# EAGLE design MUDE - Rev B (EAGLE 7.3.0)

## Sheet 1 of 2
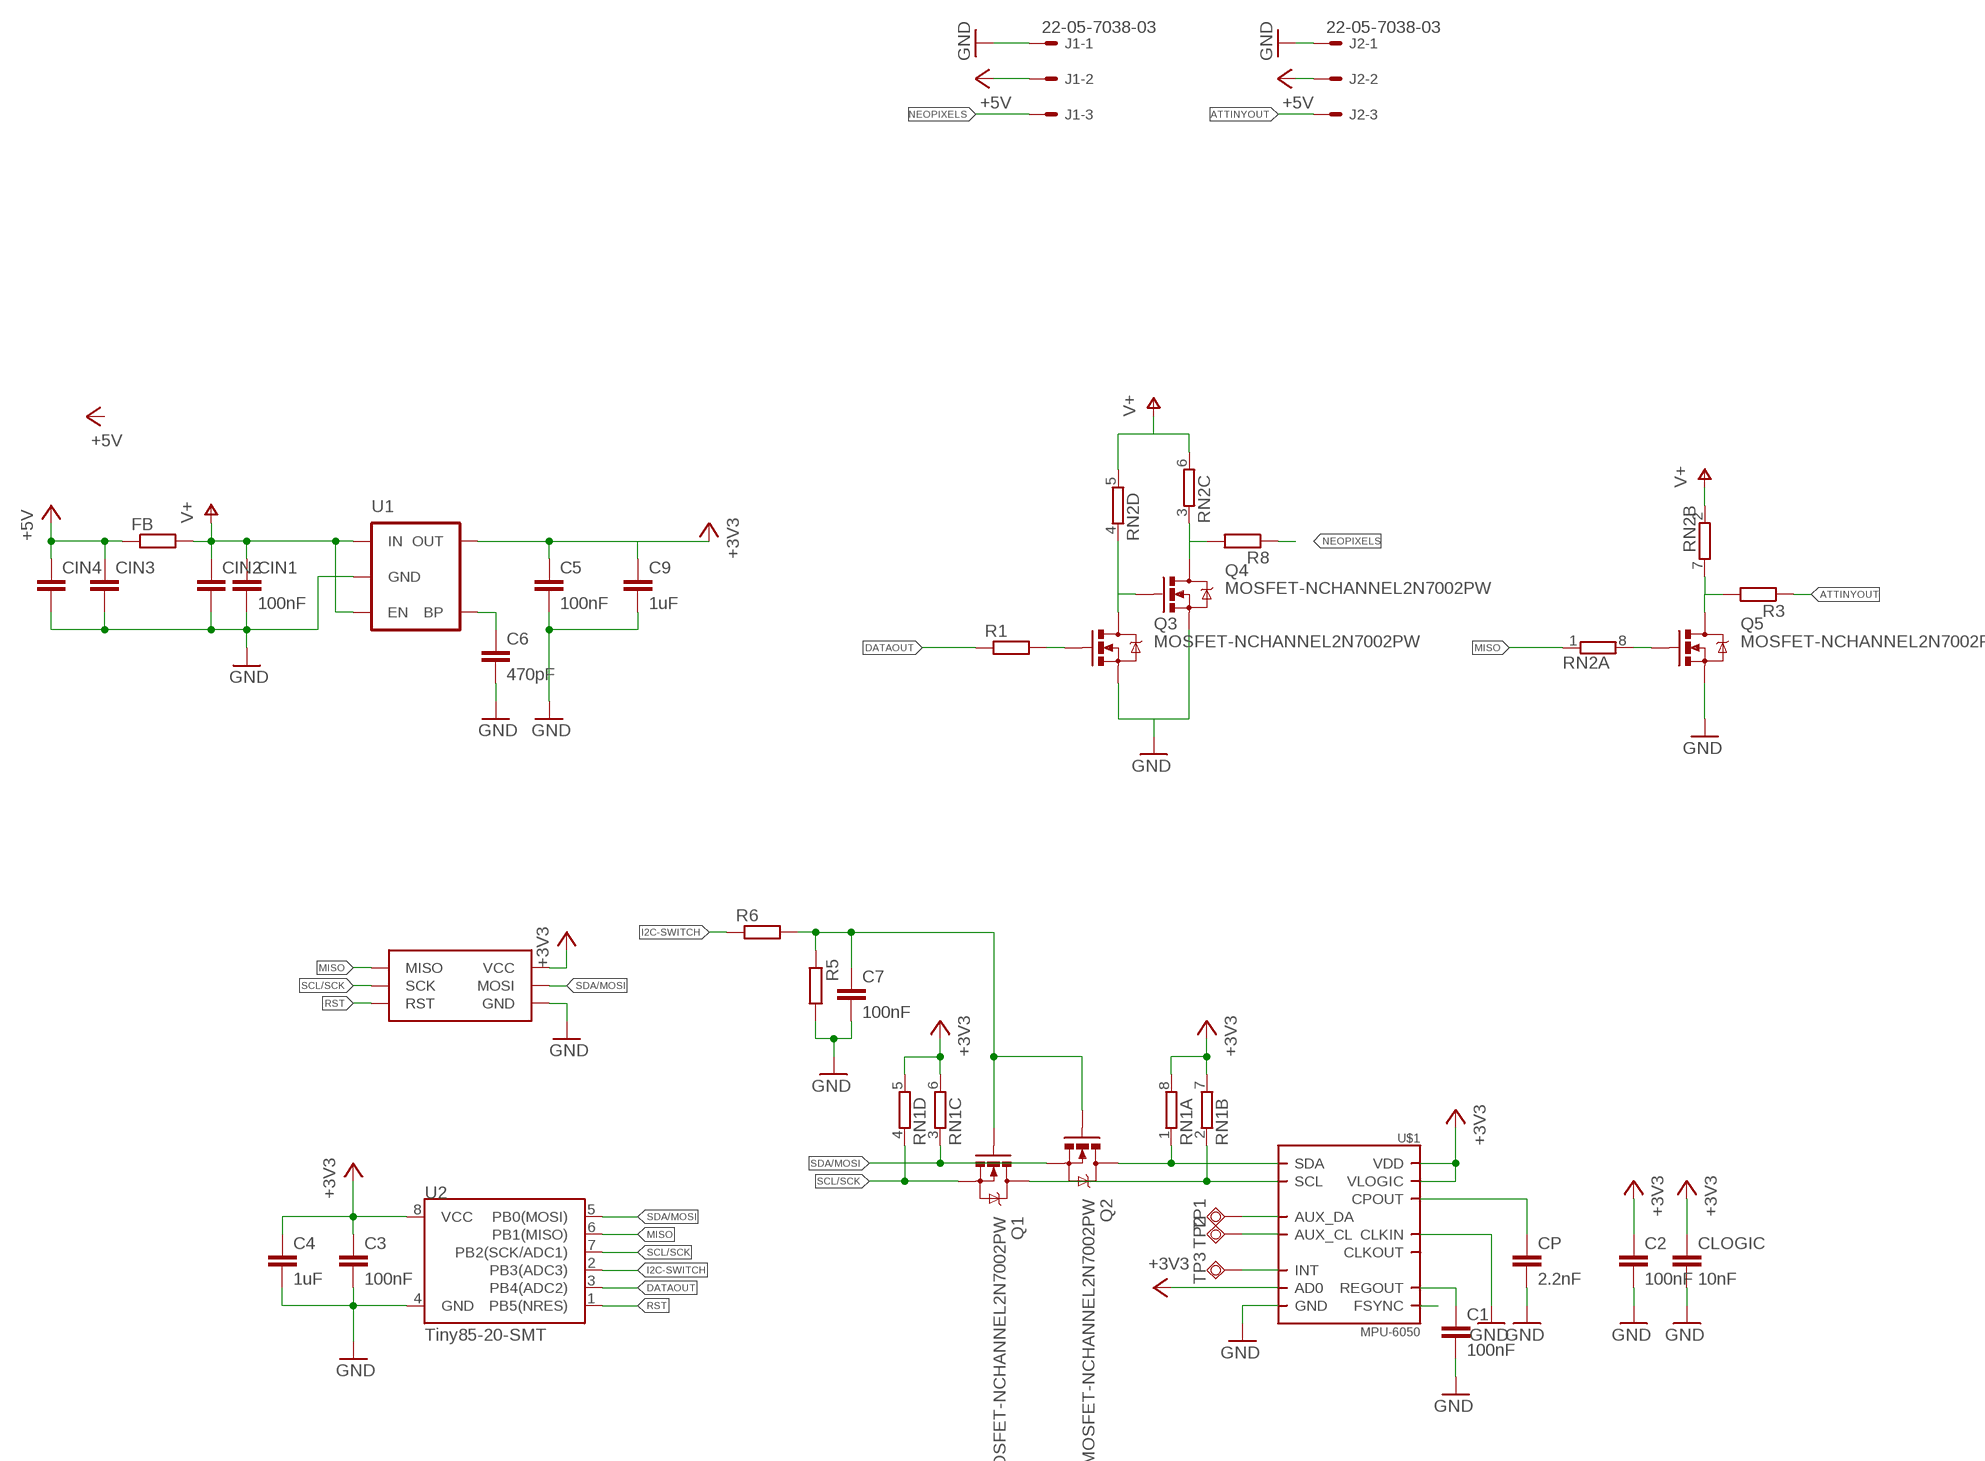
[diagram p0: schematic, sheet 1]

### Parts
C1  100nF  C-EUC0603  [C0603]
C2  100nF  C-EUC0603  [C0603]
C3  100nF  C-EUC0603  [C0603]
C4  1uF  C-EUC0603  [C0603]
C5  100nF  C-EUC0805  [C0805]
C6  470pF  C-EUC0603  [C0603]
C7  100nF  C-EUC0603  [C0603]
C9  1uF  C-EUC0603  [C0603]
CIN1  100nF  C-EUC0603  [C0603]
CIN2  C-EUC0805  [C0805]
CIN3  C-EUC0805  [C0805]
CIN4  C-EUC0805  [C0805]
CLOGIC  10nF  C-EUC0603  [C0603]
CP  2.2nF  C-EUC0603  [C0603]
FB  R-EU_R0603  [R0603]
J1  22-05-7038-03  [7395-03]
J2  22-05-7038-03  [7395-03]
Q1  MOSFET-NCHANNEL2N7002PW  [SOT323]
Q2  MOSFET-NCHANNEL2N7002PW  [SOT323]
Q3  MOSFET-NCHANNEL2N7002PW  [SOT323]
Q4  MOSFET-NCHANNEL2N7002PW  [SOT323]
Q5  MOSFET-NCHANNEL2N7002PW  [SOT323]
R1  R-EU_R0603  [R0603]
R3  R-EU_R0603  [R0603]
R5  R-EU_R0603  [R0603]
R6  R-EU_R0603  [R0603]
R8  R-EU_R0603  [R0603]
RN1  4R-N0603-ARV  [0603-ARV]
RN2  4R-N0603-ARV  [0603-ARV]
TP1  TPSQTP10R  [TP10R]
TP2  TPSQTP10R  [TP10R]
TP3  TPSQTP10R  [TP10R]
U1  MIC52053.3V  [SOT23-5]
U2  Tiny85-20-SMT  ATTINY45TINY85-20-SMT  [SO08-EIAJ]
U$1  MPU-6050  [QFN.24.4X4]
U$3  ISP_POGOISP_LHOLE  [ISP_POGO_LHOLE]

### Nets
+3V3: C2.1 C3.1 C4.1 C5.1 C9.1 CLOGIC.1 RN1.5 RN1.6 RN1.7 RN1.8 U1.5(OUT) U2.8(VCC) U$1.8(VLOGIC) U$1.9(AD0) U$1.13(VDD) U$3.VCC
ATTINYOUT: J2.3 R3.1
DATAOUT: R1.1 U2.3(PB4(ADC2))
GND: C1.2 C2.2 C3.2 C4.2 C5.2 C6.2 C7.2 C9.2 CIN1.2 CIN2.2 CIN3.2 CIN4.2 CLOGIC.2 CP.2 J1.1 J2.1 Q3.2(S) Q4.2(S) Q5.2(S) R5.2 U1.2(GND) U2.4(GND) U$1.1(CLKIN) U$1.18(GND) U$3.GND
I2C-SWITCH: R6.1 U2.2(PB3(ADC3))
MISO: RN2.1 U2.6(PB1(MISO)) U$3.MISO
N$1: CP.1 U$1.20(CPOUT)
N$2: Q5.1(G) RN2.8
N$4: TP1.TP U$1.6(AUX_DA)
N$5: C6.1 U1.4(BP)
N$6: TP2.TP U$1.7(AUX_CL)
N$7: Q2.3(D) RN1.1 U$1.24(SDA)
N$9: Q1.3(D) RN1.2 U$1.23(SCL)
N$11: TP3.TP U$1.12(INT)
N$12: C1.1 U$1.10(REGOUT)
N$13: U$1.11(FSYNC)
N$14: Q3.1(G) R1.2
N$16: Q3.3(D) Q4.1(G) RN2.4
N$17: C7.1 Q1.1(G) Q2.1(G) R5.1 R6.2
N$18: Q5.3(D) R3.2 RN2.7
N$21: Q4.3(D) R8.2 RN2.3
NEOPIXELS: J1.3 R8.1
RST: U2.1(PB5(NRES)) U$3.RST
SCL/SCK: Q1.2(S) RN1.4 U2.7(PB2(SCK/ADC1)) U$3.SCK
SDA/MOSI: Q2.2(S) RN1.3 U2.5(PB0(MOSI)) U$3.MOSI
V+: CIN1.1 CIN2.1 FB.2 RN2.2 RN2.5 RN2.6 U1.1(IN) U1.3(EN)
VIN: CIN3.1 CIN4.1 FB.1 J1.2 J2.2 ; supply symbol labelled +5V
Unconnected: U$1.22(CLKOUT)

## Sheet 2 of 2

## Library data of the parts
C1-C7 C9 CIN1-CIN4 CLOGIC CP = wes:C-EU: CAPACITOR, European symbol
FB R1 R3 R5 R6 R8 = wes:R-EU_: RESISTOR, European symbol
J1 J2 = con-molex:22-?-03: CONNECTOR wire to board 2.54 mm (.1 inch) pitch header; OC_FARNELL: unknown; OC_NEWARK: unknown
Q1-Q5 = SparkFun-DiscreteSemi:MOSFET-NCHANNEL: Common NMOSFET Parts MFG P/N Store ID Prod ID FDD8780 TRANS-09984 SI7820DN TRANS-11055 FDS6630A IC-08089 2N7002PW TRANS-11151 FQP30N06L COM-10213 TRANS-10060 BSS123LT1G TRANS-08345 BSS138 TRANS-00830 BS170 2N7000; PROD_ID: TRANS-11151
RN1 RN2 = resistor-dil:4R-N: Array Chip Resistor Source: RS Component / Phycomp; OC_FARNELL: unknown; OC_NEWARK: unknown
TP1-TP3 = testpad:TPSQ: Test pad
U1 = SparkFun-PowerIC:MIC5205: MIC5205 150mA vreg 3.3V - VREG-00822 5V - VREG-00823; PROD_ID: VREG-00822
U2 = SparkFun-DigitalIC:ATTINY45: Atmel 8-pin 2/4/8kB flash uC; PROD_ID: IC-09092
U$1 = invensense:MPU-6050
U$3 = wes:ISP_POGO

## Board
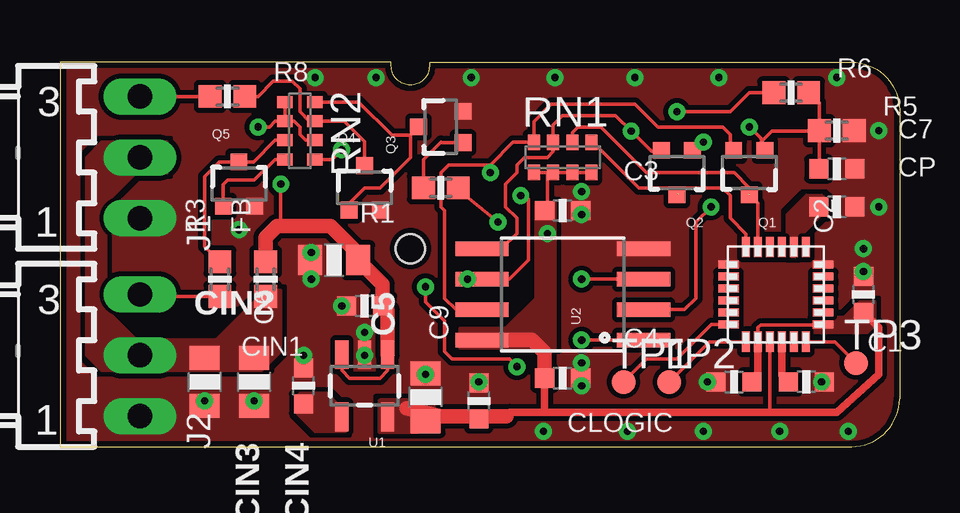
[diagram p1: board, top side]
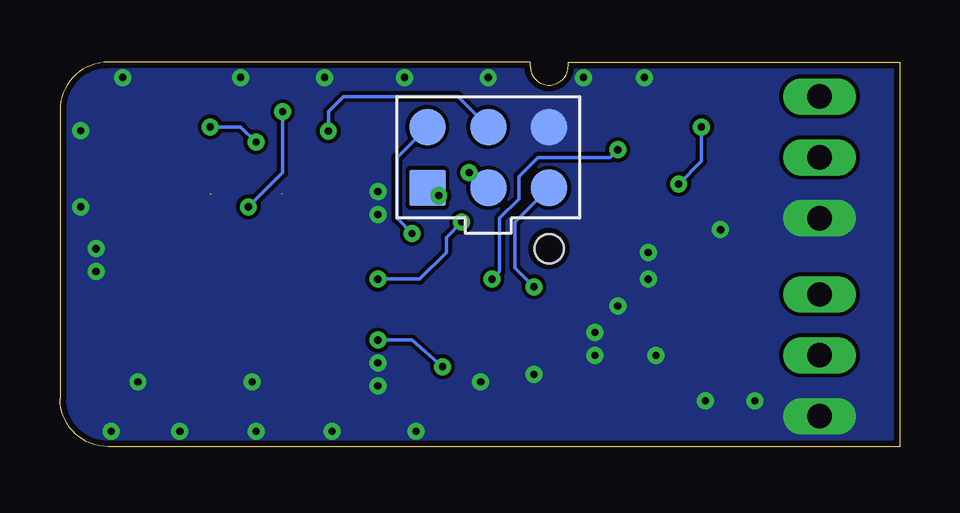
[diagram p2: board, bottom side, seen from below]

Size 35 x 16.03 mm. Coordinates in mm from the lower left corner, seen from the top.
Outline: 0,0 33,0 arc90 35,2 35,14.03 arc90 33,16.03 15.4,16.03 15.4,15.87 arc-90 14.61,15.08 arc-90 13.81,15.88 13.81,16.03 0,16.03 0,0
Copper layers (1*16): Top 0.035mm / dielectric 1.5mm / Bottom 0.035mm
Design rules "default *": minimum track width 6mil, minimum drill 0.3mm, track to track 6mil, track to pad 6mil, pad to pad 6mil, via to via 6mil, smd to smd 6mil, copper to edge 10mil, drill to drill 20mil, minimum pad ring 10mil, minimum via ring 8mil, stop-mask expansion 4mil, vias tented up to drill 0.3mm, thermal gap 10mil

### Footprints (pad centres in the part's own frame; a part is rotated, then mirrored left to right if it is on the bottom)
C0603 = smd 0.8 x 0.8: 1 -0.75,0; 2 0.75,0
C0805 = smd 1 x 1.25: 1 -1,0; 2 1,0
R0603 = smd 0.95 x 0.95: 1 -0.725,0; 2 0.725,0
7395-03 = drill 1.016 long: 1 2.54,0; 2 0,0; 3 -2.54,0
SOT323 = smd 0.7 x 0.7: 1 -0.65,-0.925; 2 0.65,-0.925; 3 0,0.925
0603-ARV = smd 0.5 x 0.65: 1 -1.2,-0.625; 2 -0.4,-0.625; 3 0.4,-0.625; 4 1.2,-0.625; 5 1.2,0.625; 6 0.4,0.625; 7 -0.4,0.625; 8 -1.2,0.625
TP10R = smd 1 x 1: TP 0,0
SOT23-5 = smd 0.55 x 1.2: 1 -0.95,-1.3; 2 0,-1.3; 3 0.95,-1.3; 4 0.95,1.3; 5 -0.95,1.3
SO08-EIAJ = smd 0.61 x 2.21: 1 -1.905,-3.378; 2 -0.635,-3.378; 3 0.635,-3.378; 4 1.905,-3.378; 5 1.905,3.353; 6 0.635,3.353; 7 -0.635,3.353; 8 -1.905,3.353
QFN.24.4X4 = smd 0.85 x 0.33: 1 -1.975,1.25; 2 -1.975,0.75; 3 -1.975,0.25; 4 -1.975,-0.25; 5 -1.975,-0.75; 6 -1.975,-1.25; 13 1.975,-1.25; 14 1.975,-0.75; 15 1.975,-0.25; 16 1.975,0.25; 17 1.975,0.75; 18 1.975,1.25 | smd 0.33 x 0.85: 7 -1.25,-1.975; 8 -0.75,-1.975; 9 -0.25,-1.975; 10 0.25,-1.975; 11 0.75,-1.975; 12 1.25,-1.975; 19 1.25,1.975; 20 0.75,1.975; 21 0.25,1.975; 22 -0.25,1.975; 23 -0.75,1.975; 24 -1.25,1.975
ISP_POGO_LHOLE = smd 1.524 x 1.524: GND 1.27,-2.54; MISO -1.27,2.54; MOSI 1.27,0; RST -1.27,-2.54; SCK -1.27,0; VCC 1.27,2.54 | hole 1.2: -3.81,-2.54

### Placement (x,y rotation side)
C1  31.11,2.7 0 top
C2  33.5,6.35 90 top
C3  20.95,9.84 0 top
C4  20.95,2.86 0 top
C5  15.24,2.06 90 top
C6  10.16,2.54 90 top
C7  32.38,11.59 0 top
C9  17.46,1.91 90 top
CIN1  12.7,5.87 180 top
CIN2  11.43,7.78 180 top
CIN3  6.03,2.7 270 top
CIN4  8.1,2.7 270 top
CLOGIC  28.1,2.7 180 top
CP  32.38,10 0 top
FB  8.57,6.99 90 top
J1  3.33,12.06 270 top
J2  3.33,3.81 270 top
Q1  28.73,11.43 180 top
Q2  25.72,11.43 180 top
Q3  15.88,13.34 90 top
Q4  12.7,10.79 0 top
Q5  7.46,10.95 0 top
R1  15.88,10.79 180 top
R3  6.67,6.99 90 top
R5  32.38,13.18 0 top
R6  30.48,14.76 0 top
R8  6.99,14.61 0 top
RN1  20.95,12.06 180 top
RN2  10,13.18 90 top
TP1  23.5,2.7 0 top
TP2  25.4,2.7 0 top
TP3  33.18,3.49 0 top
U1  12.7,2.54 180 top
U2  20.95,6.35 90 top
U$1  29.84,6.35 0 top
U$3  17.14,12.06 90 bottom

### Tracks (layer width: path | path; a pad name or v marks a point on that pad's centre or on a via)
+3V3  (via drill 0.3 pad 0.5)
  Top 0.152: RN1.5 20.33,11.44 | 20.33,11.44 RN1.6 RN1.7 RN1.8 | 20.33,9.97 C3.1 | C3.1 20.2,9.64 | C5.1 14.45,1.59 | U$1.13 31.8,5.08 29.21,5.08 29.09,4.96 U$1.8 | 20.33,11.44 20.32,10.79 20.32,9.96 C3.1 | C9.1 17.35,1.27 15.88,1.27 | U$1.9 29.59,1.52 29.84,1.43
  Top 0.305: U$1.8 29.09,3.1 CLOGIC.1 | 20.32,1.43 18.78,1.43 arc90 18.62,1.27 | 20.32,1.43 29.84,1.43 32.38,1.43 34.13,3.02 34.13,4.96 C2.1 | C4.1 20.2,1.54 arc90 20.32,1.43
  Top 0.61: U2.8 19.68,4.45 20.2,3.92 C4.1 | 14.45,1.59 15.88,1.27 18.62,1.27
  Bottom 0.152: U$3.VCC 20.95,12.06 20.95,9.53 v20.32,8.89
  pour Top (no thermals): 15.56,1.91 13.34,1.91 13.34,0.64 14.92,0.64 15.56,1.27
  pour Top (no thermals): 31.43,5.4 32.7,5.4 33.34,6.03 33.97,6.03 33.97,5.08 33.66,4.76 31.43,4.76
  pour Top (no thermals): 16.67,4.13 20.64,4.13 20.64,10.16 19.84,10.16 19.84,6.19 18.57,4.92 16.67,4.92
ATTINYOUT
  Top 0.152: R3.1 3.42,6.26 J2.3
DATAOUT  (via drill 0.3 pad 0.5)
  Top 0.152: R1.1 16.6,10.73 v18.26,9.37 | v21.75,6.99 U2.3
  Bottom 0.152: v18.26,9.37 18.89,8.73 18.89,8.1 20,6.99 v21.75,6.99
GND  (via drill 0.3 pad 0.5)
  other vias: 21.75,10.64 21.75,2.54 21.75,3.49 21.75,9.68 31.75,2.7 7.46,9.05 10.48,8.1 11.75,5.87 12.7,4.76 12.7,3.81 10.16,3.81 8.1,1.91 6.03,1.91 15.24,3.02 17.46,2.7 26.99,2.7 32.86,0.64 20.16,0.64 23.65,0.64 26.83,0.64 30,0.64 33.5,7.3 34.13,10 33.5,8.26 34.13,13.18 32.38,15.4 27.46,15.4 23.97,15.4 10.48,6.99 20.64,15.4 17.14,15.4 13.18,15.4 10.64,15.4
  pour Top (isolate 0.203, rank 6, no thermals): 0,26.04 48.26,26.04 48.26,0 0,0
  pour Bottom (no thermals): -1.91,22.23 -1.91,-1.91 42.55,-1.91 42.55,20.23 arc90 40.55,22.23
I2C-SWITCH  (via drill 0.3 pad 0.5)
  Top 0.152: U2.2 26.04,5.71 26.51,6.19 26.51,9.37 v27.15,10 | v25.72,13.97 27.94,13.97 28.73,14.76 R6.1
  Bottom 0.152: v27.15,10 25.72,11.43 v25.72,13.97
MISO  (via drill 0.3 pad 0.5)
  Top 0.152: v19.21,10.48 19.53,10.32 19.53,7.78 18.73,6.99 U2.6 v16.99,6.99 | RN2.1 11.34,11.98 v11.75,12.38
  Bottom 0.152: v19.21,10.48 19.53,10.64 U$3.MISO | v11.75,12.38 12.06,12.06 15.08,12.06 15.88,11.27 15.88,10.32 16.67,9.53 16.67,7.3 v16.99,6.99
N$1
  pour Top (no thermals): 31.75,10.48 31.11,10.48 30.32,9.68 30.32,8.1 30.48,7.94 30.64,7.94 30.8,8.1 30.8,8.73 31.91,9.84 31.91,10.32
N$2
  Top 0.152: Q5.1 6.81,10.94 6.99,11.11 8.1,11.11 8.96,11.98 RN2.8
N$4
  Top 0.152: U$1.6 27.17,5.1 25.72,3.65 24.45,3.65 TP1.TP
N$5
  pour Top (no thermals): 9.84,2.06 9.84,1.43 10.64,0.64 11.91,0.64 11.91,1.43 11.11,2.22 10,2.22
N$6
  Top 0.152: U$1.7 27.08,4.38 TP2.TP
N$7  (1 unrouted)
  Top 0.152: U$1.24 28.59,8.87 27.94,9.53 27.94,10.48 27.62,10.79 25.88,10.79 25.77,10.53 | RN1.1 22.23,12.69 24.13,10.79 25.77,10.79 25.77,10.56 Q2.3
N$9  (1 unrouted)
  Top 0.152: U$1.23 29.09,10.16 28.73,10.53 28.73,10.81 28.11,11.43 24.45,11.43 22.54,13.34 21.59,13.34 21.36,13.1 RN1.2
N$11
  Top 0.152: TP3.TP 32.3,4.38 U$1.12
N$12
  Top 0.305: U$1.10 30.09,2.97 C1.1
N$14
  Top 0.152: R1.2 15.15,11.97 15.88,12.7 15.89,12.69 Q3.1
N$16
  Top 0.152: 14.61,12.99 14.61,12.06 13.34,10.79 12.7,10.79 12.05,10.14 Q4.1 | 14.61,12.99 Q3.3 | RN2.4 12.45,14.38 13.84,12.99 14.61,12.99
N$17  (via drill 0.3 pad 0.5)
  Top 0.152: R5.1 31.66,11.77 C7.1 | R5.1 31.49,13.16 29.68,13.16 29.21,12.7 | v26.83,12.7 26.46,12.33 26.43,12.36 Q2.1 | R5.1 31.66,14.36 31.27,14.61 31.11,14.61 31.2,14.7 R6.2 | v28.73,13.34 29.21,12.86 29.28,12.7 29.21,12.7 | Q1.1 29.38,12.53 29.21,12.7
  Bottom 0.152: v28.73,13.34 27.46,13.34 v26.83,12.7
N$18
  Top 0.152: Q5.3 6.64,11.88 6.03,11.27 6.03,8.35 R3.2 | Q5.3 7.81,11.88 | 7.56,11.98 Q5.3 | RN2.7 8.97,12.78 8.07,11.88 Q5.3
N$21
  Top 0.152: R8.2 8.26,14.61 8.89,15.24 9.68,15.24 10,14.92 10,13.97 10.39,13.58 RN2.3 11.85,13.58 12.7,12.73 Q4.3
NEOPIXELS
  Top 0.152: J1.3 R8.1
RST  (via drill 0.3 pad 0.5)
  Top 0.152: U2.1 v21.75,4.45 | v19.05,3.33 18.73,3.65 16.35,3.65 16.03,3.97 16.03,5.24 15.24,6.03 v15.24,6.67
  Bottom 0.152: v21.75,4.45 20.32,4.45 v19.05,3.33 | v15.24,6.67 16.03,7.46 16.03,9.37 U$3.RST
SCL/SCK  (via drill 0.3 pad 0.5)
  Top 0.152: U2.7 16.51,5.71 16.03,6.19 16.03,9.84 15.88,10 15.88,11.43 16.19,11.75 17.94,11.75 | 19.68,12.76 RN1.4 | RN1.4 18.89,12.7 17.94,11.75 | RN1.4 19.75,13.56 20.48,14.29 23.97,14.29 24.93,13.33 27.62,13.33 27.94,13.02 27.94,12.35 27.95,12.36 Q1.2 | 17.94,11.75 v17.94,11.43
  Bottom 0.152: v17.94,11.43 17.78,11.43 U$3.SCK
SDA/MOSI  (via drill 0.3 pad 0.5)
  Top 0.152: U2.5 18.41,8.26 19.05,8.89 19.05,9.53 18.57,10 18.57,10.95 19.05,11.43 19.05,11.75 19.37,12.06 20.32,12.06 20.55,12.3 RN1.3 20.55,13.41 20.95,13.81 23.17,13.81 v23.81,13.16 24.65,12.33 25.04,12.33 Q2.2
  Bottom 0.152: U$3.MOSI 18.41,14.61 23.18,14.61 23.81,13.97 v23.81,13.16
V+  (via drill 0.3 pad 0.5)
  Top 0.152: RN2.5 RN2.6 | RN2.6 8.97,13.58 8.73,13.34 v8.26,13.34 | U1.3 11.75,3.17 12.06,2.86 13.34,2.86 13.65,3.17 U1.1 | RN2.6 9.76,13.58 10,13.34 10,13.02 10.24,12.78 RN2.2 | v9.21,10.95 9.21,9.37 9.05,9.21
  Top 0.61: FB.2 8.57,8.73 9.05,9.21 11.27,9.21 12.43,8.05 CIN2.1 13.45,6.76 CIN1.1 13.65,5.67 U1.1
  Bottom 0.152: v9.21,10.95 8.26,11.91 v8.26,13.34
VIN
  pour Top (no thermals): 4.45,12.7 1.75,12.7 1.11,12.06 1.11,3.81 1.75,3.17 4.45,3.17 4.45,4.45 3.17,4.45 1.91,5.71 1.91,10.16 3.17,11.43 4.45,11.43
  pour Top (no thermals): 3.17,3.17 8.41,3.17 9.21,3.97 9.21,6.51 8.57,6.51 6.51,4.45 3.17,4.45